# Altium schematic sheet Led.SchDoc
size 127 x 127 mm
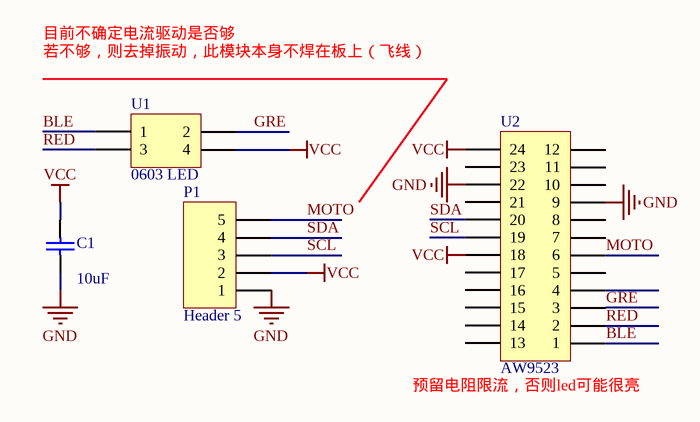
[diagram p0: Led.SchDoc]

## Parts
C1  value 10uF  [1608[0603]]  (hidden comment: Cap Semi)
P1  Header 5  [Pad_5]
U1  0603 LED  [LED]
U2  AW9523  [AW9523]

## Nets
GND: C1.1 P1.1 U2.9 U2.22
VCC: C1.2 P1.2 U1.4 U2.18 U2.24
BLE: U1.1 U2.1
GRE: U1.2 U2.3
MOTO: P1.5 U2.6
RED: U1.3 U2.2
SCL: P1.3 U2.19
SDA: P1.4 U2.20

Not connected (* = marked no-connect by the designer): U2 4 5 7 8 10 11 12 13 14 15 16 17 21 23

## Notes on the sheet
- 若不够，则去掉振动，此模块本身不焊在板上（飞线）
- 目前不确定电流驱动是否够
- (near U2) 预留电阻限流，否则led可能很亮

## Library data of the parts
C1 = Cap Semi: Capacitor (Semiconductor SIM Model); Published: 8-Jun-2000; LatestRevisionDate: 29-May-2009; LatestRevisionNote: IPC-7351 Footprint Added.; PackageReference: C1206; Publisher: Altium Limited; PackageDescription: Chip Capacitor
P1 = Header 5: Header, 5-Pin; LatestRevisionDate: 17-Jul-2002; LatestRevisionNote: Re-released for DXP Platform.; Publisher: Altium Limited
U1 = Header 2X2: Header, 2-Pin, Dual row; LatestRevisionDate: 17-Jul-2002; LatestRevisionNote: Re-released for DXP Platform.; Publisher: Altium Limited
U2 = Header 12X2A: Header, 12-Pin, Dual row; LatestRevisionDate: 17-Jul-2002; LatestRevisionNote: Re-released for DXP Platform.; Publisher: Altium Limited